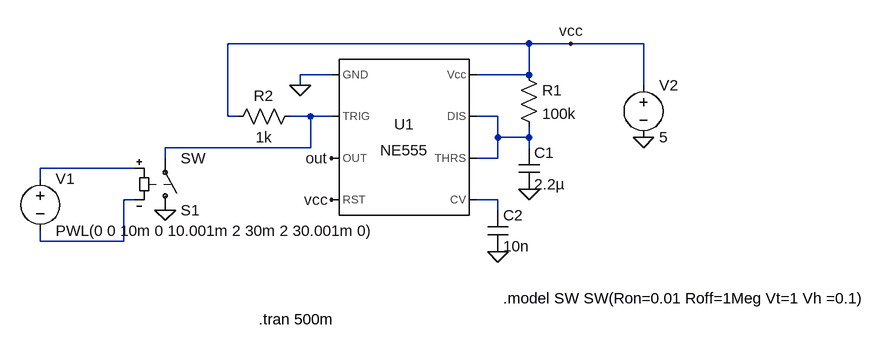
[diagram p0: schematic monostable 555.asc]
monostable 555.asc, the LTspice schematic file:
Version 4
SHEET 1 1000 680
WIRE 432 16 -32 16
WIRE 496 16 432 16
WIRE 608 16 496 16
WIRE 128 64 80 64
WIRE 432 64 432 16
WIRE 432 64 352 64
WIRE 80 80 80 64
WIRE 608 80 608 16
WIRE -32 128 -32 16
WIRE -16 128 -32 128
WIRE 96 128 64 128
WIRE 128 128 96 128
WIRE 384 128 352 128
WIRE 384 160 384 128
WIRE 432 160 432 144
WIRE 432 160 384 160
WIRE 96 176 96 128
WIRE 96 176 -128 176
WIRE 432 176 432 160
WIRE -128 192 -128 176
WIRE 384 192 384 160
WIRE 384 192 352 192
WIRE -176 208 -320 208
WIRE -320 224 -320 208
WIRE -176 256 -192 256
WIRE 384 256 352 256
WIRE 384 272 384 256
WIRE -320 320 -320 304
WIRE -192 320 -192 256
WIRE -192 320 -320 320
FLAG 80 80 0
FLAG 432 240 0
FLAG 384 336 0
FLAG -128 272 0
FLAG 608 160 0
FLAG 496 16 vcc
FLAG 128 256 vcc
FLAG 128 192 out
SYMBOL Misc\\NE555 240 160 R0
SYMATTR InstName U1
SYMBOL res 416 48 R0
SYMATTR InstName R1
SYMATTR Value 100k
SYMBOL cap 416 176 R0
SYMATTR InstName C1
SYMATTR Value 2.2µ
SYMBOL res 80 112 R90
WINDOW 0 0 56 VBottom 2
WINDOW 3 32 56 VTop 2
SYMATTR InstName R2
SYMATTR Value 1k
SYMBOL cap 368 272 R0
SYMATTR InstName C2
SYMATTR Value 10n
SYMBOL sw -128 288 M180
SYMATTR InstName S1
SYMBOL voltage -320 208 R0
WINDOW 123 0 0 Left 0
WINDOW 39 0 0 Left 0
SYMATTR InstName V1
SYMATTR Value PWL(0 0 10m 0 10.001m 2 30m 2 30.001m 0)
SYMBOL voltage 608 64 R0
WINDOW 123 0 0 Left 0
WINDOW 39 0 0 Left 0
SYMATTR InstName V2
SYMATTR Value 5
TEXT 392 408 Left 2 !.model SW SW(Ron=0.01 Roff=1Meg Vt=1 Vh =0.1)
TEXT 16 440 Left 2 !.tran 500m

The netlist it stands for:
* monostable 555.asc
XU1 0 N001 out vcc N005 N002 N002 vcc NE555  ; pins GND TRIG OUT RST CV THRS DIS Vcc
R1 vcc N002 100k
C1 N002 0 2.2µ
R2 N001 vcc 1k
C2 N005 0 10n
S1 0 N001 N003 N004 SW
V1 N003 N004 PWL(0 0 10m 0 10.001m 2 30m 2 30.001m 0)
V2 vcc 0 5
.model SW SW(Ron=0.01 Roff=1Meg Vt=1 Vh =0.1)
.tran 500m
.lib NE555.sub
.backanno
.end